# EAGLE design Universal RGB to YPbPR (EAGLE 6.5.0)
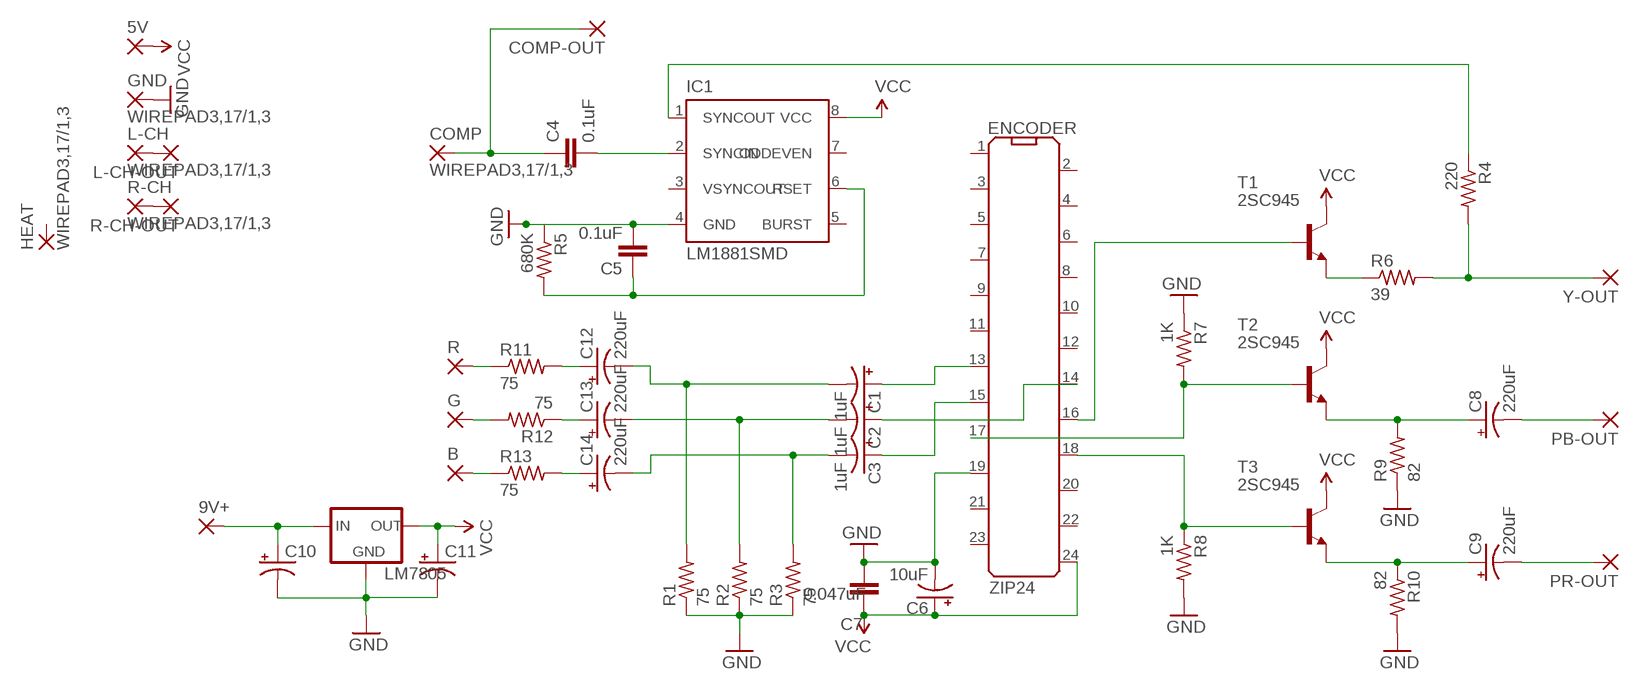
[diagram p0: schematic, sheet 1]

## Parts
5V  WIREPAD3,17/1,3  [3,17/1,3]
9V+  WIREPAD3,17/1,3  [3,17/1,3]
B  WIREPAD3,17/1,3  [3,17/1,3]
C1  1uF  CAP_POLPTH2  [CPOL-RADIAL-10UF-25V]
C2  1uF  CAP_POLPTH2  [CPOL-RADIAL-10UF-25V]
C3  1uF  CAP_POLPTH2  [CPOL-RADIAL-10UF-25V]
C4  0.1uF  C-EU025-024X044  [C025-024X044]
C5  0.1uF  C-EU025-024X044  [C025-024X044]
C6  10uF  CAP_POLPTH2  [CPOL-RADIAL-10UF-25V]
C7  0.047uF  C-EU025-024X044  [C025-024X044]
C8  220uF  CAP_POLPTH4  [CPOL-RADIAL-1000UF-25V]
C9  220uF  CAP_POLPTH4  [CPOL-RADIAL-1000UF-25V]
C10  CAP_POLPTH1  [CPOL-RADIAL-100UF-25V]
C11  CAP_POLPTH1  [CPOL-RADIAL-100UF-25V]
C12  220uF  CAP_POLPTH4  [CPOL-RADIAL-1000UF-25V]
C13  220uF  CAP_POLPTH4  [CPOL-RADIAL-1000UF-25V]
C14  220uF  CAP_POLPTH4  [CPOL-RADIAL-1000UF-25V]
COMP  WIREPAD3,17/1,3  [3,17/1,3]
COMP-OUT  WIREPAD3,17/1,3  [3,17/1,3]
ENCODER  ZIP24  [ZIP24]
G  WIREPAD3,17/1,3  [3,17/1,3]
GND  WIREPAD3,17/1,3  [3,17/1,3]
HEAT  WIREPAD3,17/1,3  [3,17/1,3]
IC1  LM1881SMD  [SO08]
L-CH  WIREPAD3,17/1,3  [3,17/1,3]
L-CH-OUT  WIREPAD3,17/1,3  [3,17/1,3]
LM7805  V_REG_78XX  [DPAK]
PB-OUT  WIREPAD3,17/1,3  [3,17/1,3]
PR-OUT  WIREPAD3,17/1,3  [3,17/1,3]
R  WIREPAD3,17/1,3  [3,17/1,3]
R1  75  R-US_0207/2V  [0207/2V]
R2  75  R-US_0207/2V  [0207/2V]
R3  75  R-US_0207/2V  [0207/2V]
R4  220  R-US_0207/2V  [0207/2V]
R5  680K  R-US_0207/2V  [0207/2V]
R6  39  R-US_0207/2V  [0207/2V]
R7  1K  R-US_0207/2V  [0207/2V]
R8  1K  R-US_0207/2V  [0207/2V]
R9  82  R-US_0207/2V  [0207/2V]
R10  82  R-US_0207/2V  [0207/2V]
R11  75  R-US_0207/2V  [0207/2V]
R12  75  R-US_0207/2V  [0207/2V]
R13  75  R-US_0207/2V  [0207/2V]
R-CH  WIREPAD3,17/1,3  [3,17/1,3]
R-CH-OUT  WIREPAD3,17/1,3  [3,17/1,3]
T1  2SC945  [TO92-ECB]
T2  2SC945  [TO92-ECB]
T3  2SC945  [TO92-ECB]
Y-OUT  WIREPAD3,17/1,3  [3,17/1,3]

## Nets
GND: C5.2 C6.2(-) C7.2 C10.2(-) C11.2(-) ENCODER.19(GND) GND.1(P) IC1.4(GND) LM7805.4(GND) R1.1 R2.1 R3.1 R5.1 R7.1 R8.2 R9.1 R10.2
N$1: C8.1(+) R9.2 T2.E
N$2: C9.1(+) R10.1 T3.E
N$3: C9.2(-) PR-OUT.1(P)
N$4: L-CH-OUT.1(P) L-CH.1(P)
N$5: R-CH-OUT.1(P) R-CH.1(P)
N$10: C8.2(-) PB-OUT.1(P)
N$11: 9V+.1(P) C10.1(+) LM7805.1(IN)
N$12: R11.1 R.1(P)
N$13: C4.2 IC1.2(SYNCIN)
N$14: C1.2(-) C12.2(-) R1.2
N$15: C2.2(-) C13.2(-) R2.2
N$16: C3.2(-) C14.2(-) R3.2
N$17: G.1(P) R12.2
N$18: B.1(P) R13.1
N$19: C14.1(+) R13.2
N$20: C13.1(+) R12.1
N$21: C12.1(+) R11.2
N$24: C1.1(+) ENCODER.13(AR)
N$25: C2.1(+) ENCODER.14(AG)
N$26: C3.1(+) ENCODER.15(AB)
N$27: C4.1 COMP-OUT.1(P) COMP.1(P)
N$29: ENCODER.16(Y-OUT) T1.B
N$30: ENCODER.17(B-Y-OUT) R7.2 T2.B
N$31: ENCODER.18(R-Y-OUT) R8.1 T3.B
N$34: IC1.1(SYNCOUT) R4.1
N$40: C5.1 IC1.6(RSET) R5.2
N$47: R6.1 T1.E
N$50: R4.2 R6.2 Y-OUT.1(P)
VCC: 5V.1(P) C6.1(+) C7.1 C11.1(+) ENCODER.24(VCC) IC1.8(VCC) LM7805.3(OUT) T1.C T2.C T3.C
Unconnected: ENCODER.1(VID-OUT) ENCODER.2(SYNC-IN) ENCODER.3(Y-IN) ENCODER.4(B-Y-IN) ENCODER.5(R-Y-IN) ENCODER.6(BURST-LV-ADJ) ENCODER.7(VC) ENCODER.8(VB) ENCODER.9(VA) ENCODER.10(BFP-IN) ENCODER.11(APC-PHASE-ADJ) ENCODER.12(PD) ENCODER.20(VID-IN) ENCODER.21(PCP-IN) ENCODER.22(HDP-IN) ENCODER.23(YSP-IN) HEAT.1(P) IC1.3(VSYNCOUT) IC1.5(BURST) IC1.7(ODDEVEN)

## Library data of the parts
5V 9V+ B COMP COMP-OUT G GND HEAT L-CH L-CH-OUT PB-OUT PR-OUT R R-CH R-CH-OUT Y-OUT = wirepad:WIREPAD: Wire PAD connect wire on PCB
C1-C3 C6 C8-C14 = SparkFun-Capacitors:CAP_POL: Capacitor Polarized These are standard SMD and PTH capacitors. Normally 10uF, 47uF, and 100uF in electrolytic and tantalum varieties. Always verify the external diameter of the through hole cap, it varies with capacity, voltage, and manufacturer. The EIA devices should be standard.
C4 C5 C7 = resistor:C-EU: CAPACITOR, European symbol
ENCODER = BA7230LS:ZIP24
IC1 = linear:LM1881
LM7805 = SparkFun-PowerIC:V_REG_78XX: Voltage Regulator Standard 7805 5V regulator. IGO (Input Ground Output). Spark Fun Electronics SKU : COM-00107
R1-R13 = resistor:R-US_: RESISTOR, American symbol
T1-T3 = transistor:2SC945: NPN Silicon Epitaxial Planar Transistor Source: SEMTECH ELECTRONICS LTD. ... 2SC945 2.pdf

## Board
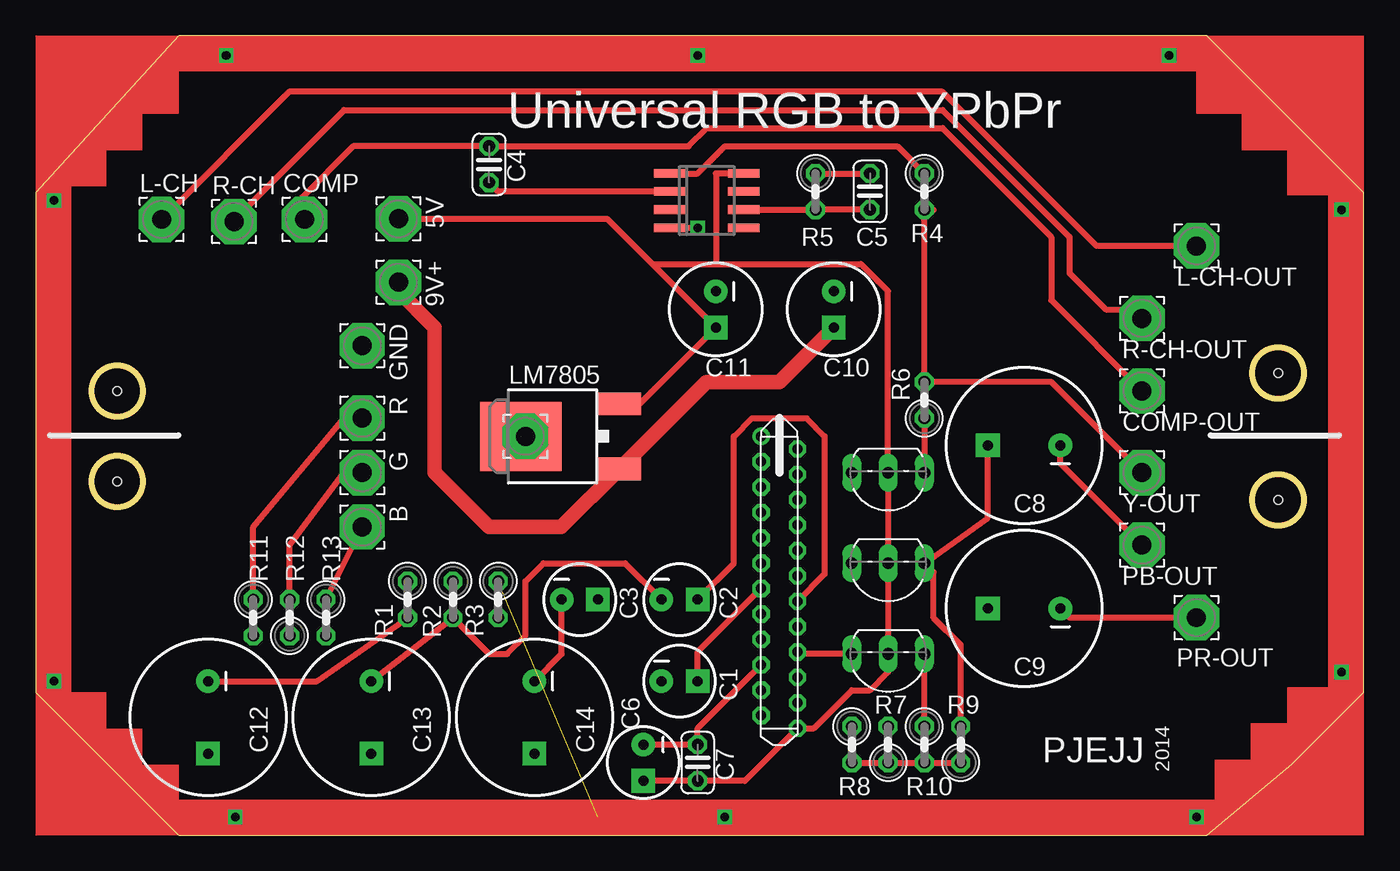
[diagram p1: board, top side]
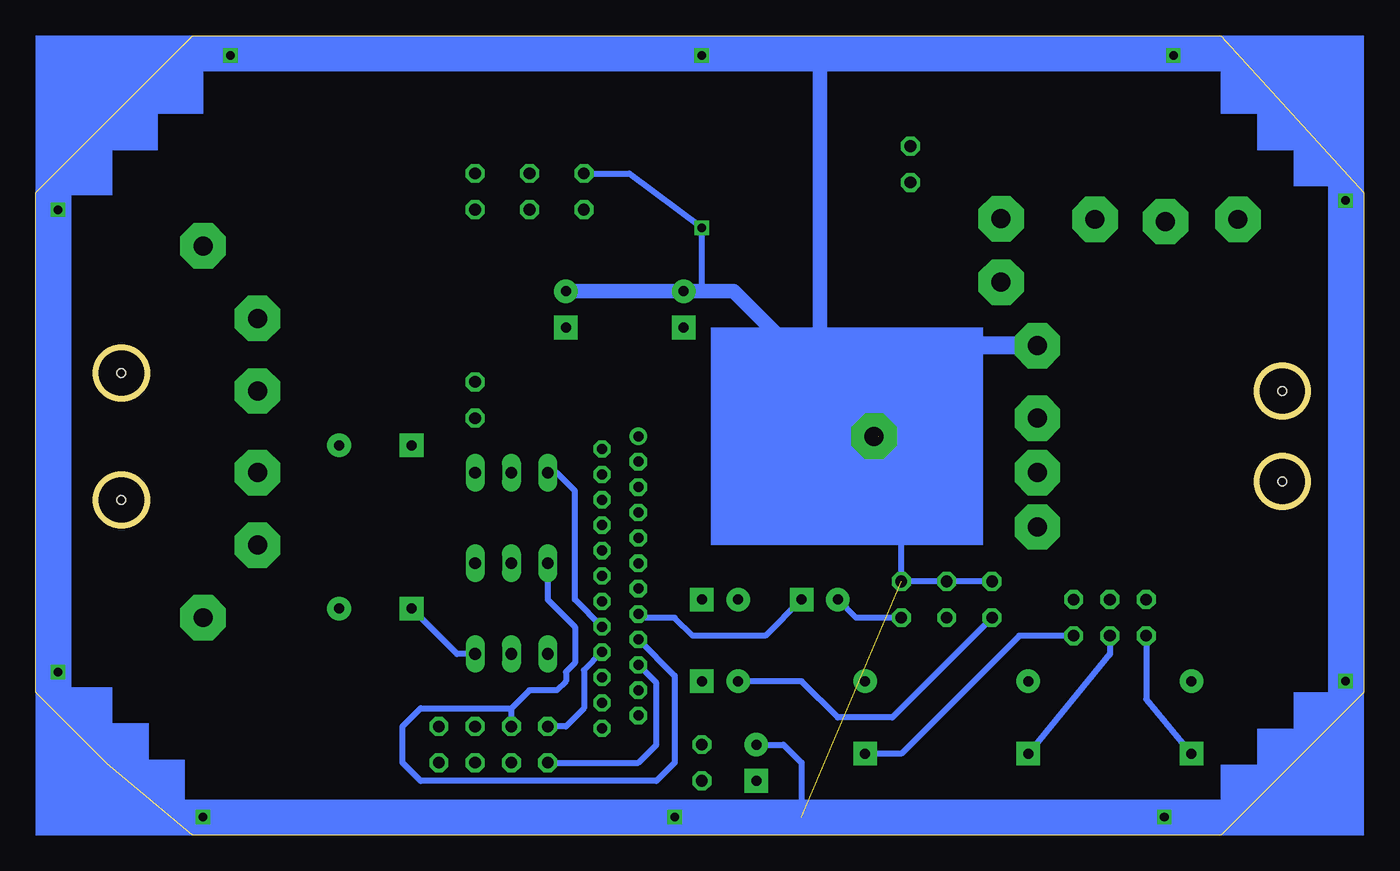
[diagram p2: board, bottom side, seen from below]

Size 93 x 56 mm. Coordinates in mm from the lower left corner, seen from the top.
Outline: 0,10 10,0 82,0 88,5 93,10 93,45 82,56 10,56 0,45 0,10
Outline: circle at 87,32.38 radius 1.8
Outline: circle at 87,23.5 radius 1.8
Outline: circle at 5.71,31.11 radius 1.8
Outline: circle at 5.71,24.77 radius 1.8
Copper layers (1*16): Top 0.035mm / dielectric 1.5mm / Bottom 0.035mm
Design rules "default": minimum track width 10mil, minimum drill 0.6mm, track to track 8mil, track to pad 8mil, pad to pad 8mil, via to via 8mil, smd to smd 8mil, copper to edge 40mil, drill to drill 8mil, minimum pad ring 10mil, minimum via ring 8mil, stop-mask expansion 4mil, vias tented up to drill 0mil, thermal gap 10mil
Holes 0.6 mm at 87,23.5 87,32.38 5.71,24.77 5.71,31.11

### Footprints (pad centres in the part's own frame; a part is rotated, then mirrored left to right if it is on the bottom)
3,17/1,3 = drill 1.321 pad 3.175 octagon: 1 0,0
CPOL-RADIAL-10UF-25V = drill 0.7 pad 1.651 square: 1 1.27,0 | drill 0.7 pad 1.651: 2 -1.27,0
C025-024X044 = drill 0.813 octagon: 1 -1.27,0; 2 1.27,0
CPOL-RADIAL-1000UF-25V = drill 0.7 pad 1.651 square: 1 2.54,0 | drill 0.7 pad 1.651: 2 -2.54,0
CPOL-RADIAL-100UF-25V = drill 0.7 pad 1.651 square: 1 1.27,0 | drill 0.7 pad 1.651: 2 -1.27,0
ZIP24 = drill 0.7: 1 0,0 | drill 0.7 octagon: 2 0.889,2.54; 3 1.778,0; 4 2.667,2.54; 5 3.556,0; 6 4.445,2.54; 7 5.334,0; 8 6.223,2.54; 9 7.112,0; 10 8.001,2.54; 11 8.89,0; 12 9.779,2.54; 13 10.668,0; 14 11.557,2.54; 15 12.446,0; 16 13.335,2.54; 17 14.224,0; 18 15.113,2.54; 19 16.002,0; 20 16.891,2.54; 21 17.78,0; 22 18.669,2.54; 23 19.558,0; 24 20.447,2.54
SO08 = smd 0.6 x 2.2: 1 -1.905,-2.6; 2 -0.635,-2.6; 3 0.635,-2.6; 4 1.905,-2.6; 5 1.905,2.6; 6 0.635,2.6; 7 -0.635,2.6; 8 -1.905,2.6
DPAK = smd 1.6 x 3: 1 -2.28,-5.31; 3 2.28,-5.31 | smd 4.826 x 5.715: 4 0,1.588
0207/2V = drill 0.813 octagon: 1 -1.27,0; 2 1.27,0
TO92-ECB = drill 0.813 long: B 2.54,0; C 0,0; E -2.54,0

### Placement (x,y rotation side)
5V  25.4,43.18 270 top
9V+  25.4,38.73 270 top
B  22.86,21.59 270 top
C1  45.09,10.79 0 top
C2  45.09,16.51 0 top
C3  38.1,16.51 0 top
C4  31.75,46.99 270 top
C5  58.42,45.09 90 top
C6  42.55,5.08 270 top
C7  46.35,5.08 90 top
C8  69.22,27.3 180 top
C9  69.22,15.88 180 top
C10  55.88,36.83 270 top
C11  47.62,36.83 270 top
C12  12.06,8.26 270 top
C13  23.5,8.26 270 top
C14  34.92,8.26 270 top
COMP  18.82,43.13 0 top
COMP-OUT  77.47,31.11 180 top
ENCODER  50.8,27.94 270 top
G  22.86,25.4 270 top
GND  22.86,34.29 270 top
HEAT  34.29,27.94 0 top
IC1  46.99,44.45 270 top
L-CH  8.81,43.13 0 top
L-CH-OUT  81.28,41.27 180 top
LM7805  35.56,27.94 90 top
PB-OUT  77.47,20.32 270 top
PR-OUT  81.28,15.24 0 top
R  22.86,29.21 270 top
R1  26.04,16.51 270 top
R2  29.21,16.51 270 top
R3  32.38,16.51 270 top
R4  62.23,45.09 270 top
R5  54.61,45.09 270 top
R6  62.23,30.48 90 top
R7  59.69,6.35 90 top
R8  57.15,6.35 270 top
R9  64.77,6.35 90 top
R10  62.23,6.35 270 top
R11  15.24,15.24 270 top
R12  17.78,15.24 90 top
R13  20.32,15.24 270 top
R-CH  13.89,42.98 0 top
R-CH-OUT  77.47,36.2 0 top
T1  59.69,25.4 180 top
T2  59.69,19.05 180 top
T3  59.69,12.7 180 top
Y-OUT  77.47,25.4 0 top

### Tracks (layer width: path | path; a pad name or v marks a point on that pad's centre or on a via)
GND  (via drill 0.6)  (2 unrouted)
  Top 0.406: R5.1 C5.2 | v46.35,42.55 46.27,42.63 46.17,42.55 IC1.4 44.67,42.55 | R8.2 R7.1 R10.2 R9.1 | C6.2 C7.2 46.35,7.49 ENCODER.19
  Bottom 0.406: R5.1 51.44,46.35 v46.35,42.55 46.35,38.1 | R8.2 50.8,5.08 49.53,6.35 49.53,10.67 ENCODER.19 | LM7805.4 34.78,27.37 32.38,24.97 R3.1 R2.1 R1.1 | C6.2 40.64,6.35 39.37,5.08 39.37,1.27
  Bottom 1.016: C10.2 C11.2 46.35,38.1 44.13,38.1 LM7805.4
  Bottom 1.27: GND.1 27.94,34.29 27.94,33.97 LM7805.4
N$1
  Top 0.406: C8.1 66.67,22.23 T2.E 62.87,18.41 62.87,15.24 64.77,13.34 R9.2
N$2
  Top 0.406: R10.1 T3.E
  Bottom 0.406: T3.E 63.5,12.7 C9.1
N$3
  Top 0.406: PR-OUT.1 72.39,15.24 C9.2
N$4
  Top 0.406: L-CH-OUT.1 74.3,41.27 63.5,52.07 17.75,52.07 L-CH.1
N$5
  Top 0.406: R-CH-OUT.1 76.83,36.83 74.93,36.83 72.39,39.37 72.39,41.91 63.5,50.8 21.59,50.8 13.89,43.1 R-CH.1
N$6  (via drill 0.6)
  other vias: 1.27,44.45
N$7  (via drill 0.6)
  other vias: 91.44,43.81
N$8  (via drill 0.6)
  other vias: 91.44,11.43
N$9  (via drill 0.6)
  other vias: 1.27,10.79
N$10
  Top 0.406: PB-OUT.1 71.75,26.04 C8.2
N$11
  Top 1.016: C10.1 52.07,31.75 46.96,31.75 LM7805.1 36.8,21.59 31.75,21.59 27.94,25.4 27.94,35.56 25.4,38.1
  Top 1.27: 9V+.1 25.4,38.1
N$12
  Top 0.406: R11.1 15.24,21.59 21.59,29.21 R.1
N$13
  Top 0.406: 44.58,45.09 IC1.2 32.38,45.09 C4.2
N$14
  Top 0.406: C12.2 19.68,10.79 R1.2
  Bottom 0.406: C1.2 39.37,10.79 36.83,8.26 33.02,8.26 R1.2
N$15
  Top 0.406: C13.2 R2.2 31.75,12.7 33.02,12.7 34.29,13.97 34.29,17.78 35.56,19.05 41.27,19.05 C2.2
N$16
  Top 0.406: C14.2 36.83,12.7 C3.2
  Bottom 0.406: R3.2 35.56,15.24 C3.2
N$17
  Top 0.406: R12.2 17.78,20.32 21.59,25.4 G.1
N$18
  Top 0.406: R13.1 B.1
N$19
  Bottom 0.406: R13.2 24.13,13.97 32.38,5.71 C14.1
N$20
  Bottom 0.406: R12.1 17.78,12.7 C13.1
N$21
  Bottom 0.406: R11.2 15.24,9.53 C12.1
N$22
  Bottom 1.016: 38.1,54.61 38.1,29.21
N$24
  Top 0.406: C1.1 46.35,12.83 ENCODER.13
N$25
  Top 0.406: ENCODER.14 55.24,18.29 55.24,27.94 53.98,29.21 50.16,29.21 48.9,27.94 48.9,19.05 C2.1
N$26
  Bottom 0.406: C3.1 41.91,13.97 46.99,13.97 48.26,15.24 50.55,15.24 ENCODER.15
N$27
  Top 0.406: COMP.1 18.64,44.67 22.23,48.26 C4.1 45.72,48.26 46.99,49.53 63.5,49.53 71.12,41.91 71.12,37.47 COMP-OUT.1
N$28  (via drill 0.6)
  other vias: 13.97,1.27
N$29
  Bottom 0.406: ENCODER.16 55.24,16.51 55.24,24.13 56.52,25.4 T1.B
N$30
  Bottom 0.406: T2.B 57.15,16.51 55.24,14.61 55.24,12.06 55.88,11.43 55.88,10.79 56.52,10.16 58.42,10.16 59.69,8.89 | 59.69,8.89 66.04,8.89 67.31,7.62 67.31,5.08 66.04,3.81 49.53,3.81 48.26,5.08 48.26,11.18 ENCODER.17 | R7.2 59.69,8.89
N$31
  Top 0.406: T3.B 53.47,12.7 ENCODER.18
  Bottom 0.406: ENCODER.18 54.61,11.56 54.61,8.89 55.88,7.62 R8.1
N$32  (via drill 0.6)
  other vias: 48.26,1.27
N$34
  Top 0.406: R4.1 60.33,48.26 48.26,48.26 46.35,46.35 IC1.1
N$35  (via drill 0.6)
  other vias: 13.34,54.61
N$36  (via drill 0.6)
  other vias: 46.35,54.61
N$37  (via drill 0.6)
  other vias: 79.38,54.61
N$38  (via drill 0.6)
  other vias: 81.28,1.27
N$40
  Top 0.406: C5.1 R5.2 | R5.2 54.52,43.91 | IC1.6 R5.2
N$47
  Top 0.406: R6.1 T1.E
N$50
  Top 0.406: 62.87,43.81 R4.2 R6.2 71.12,31.75 Y-OUT.1
VCC
  Top 0.406: IC1.8 49.62,46.45 49.53,46.35 47.62,46.35 47.62,40.01 | 43.18,40.01 47.62,40.01 | 47.62,40.01 57.78,40.01 59.69,38.1 T1.C T2.C T3.C 59.69,11.43 58.42,10.16 57.15,10.16 54.48,7.49 ENCODER.24 49.66,3.81 C7.1 C6.1 | 5V.1 40.01,43.18 43.18,40.01 | 43.18,40.01 C11.1 42.28,30.22 LM7805.3
(copper drawn outside any net)
  shapes: Bottom area x18, Top area x17

### Text on the board
tPlace: Universal RGB to YPbPr | 2014
tNames: PJEJJ